# EAGLE design opentx (EAGLE 9.3.2)
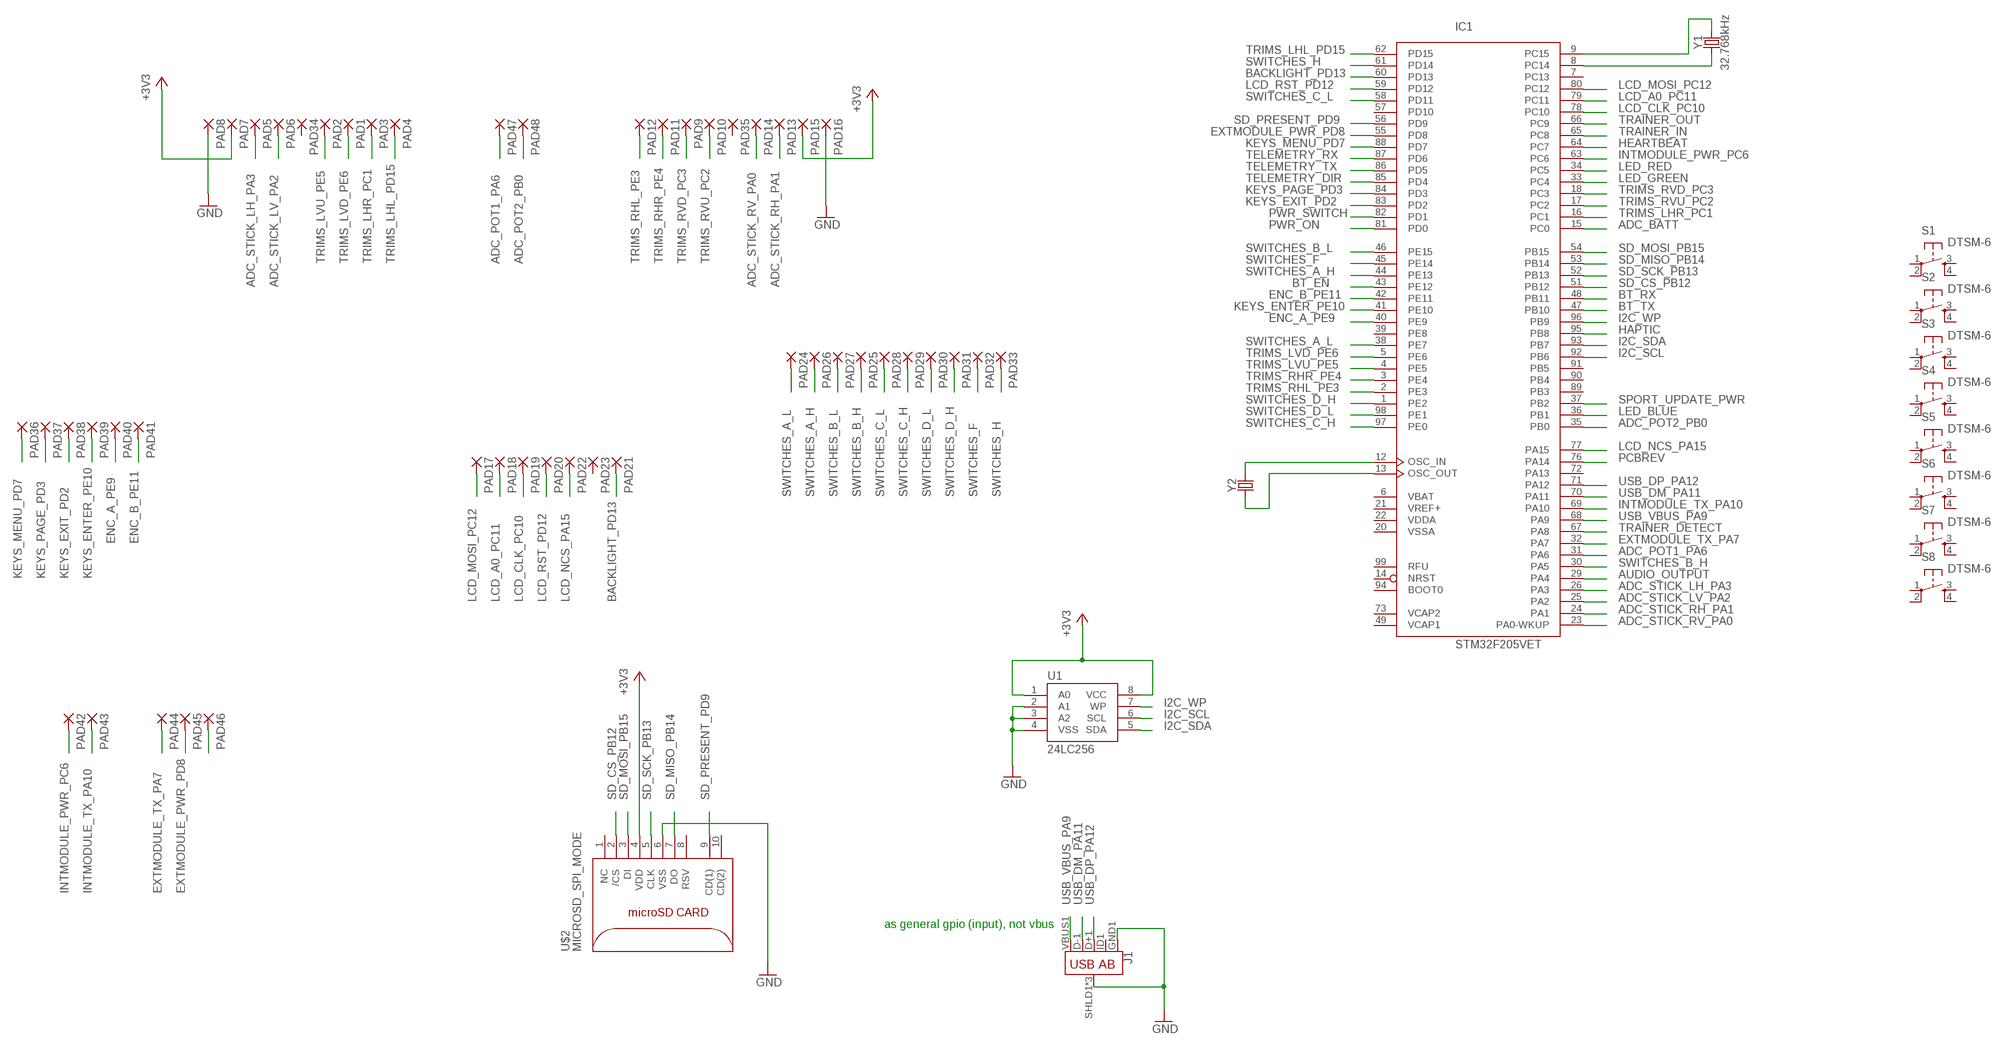
[diagram p0: schematic, sheet 1]

## Parts
IC1  STM32F205VET  [LQFP100]
J1  USB_AB_SMT  [USB-AB-MICRO-SMD]
PAD1  SMD2  [SMD1,27-2,54]
PAD2  SMD2  [SMD1,27-2,54]
PAD3  SMD2  [SMD1,27-2,54]
PAD4  SMD2  [SMD1,27-2,54]
PAD5  SMD2  [SMD1,27-2,54]
PAD6  SMD2  [SMD1,27-2,54]
PAD7  SMD2  [SMD1,27-2,54]
PAD8  SMD2  [SMD1,27-2,54]
PAD9  SMD2  [SMD1,27-2,54]
PAD10  SMD2  [SMD1,27-2,54]
PAD11  SMD2  [SMD1,27-2,54]
PAD12  SMD2  [SMD1,27-2,54]
PAD13  SMD2  [SMD1,27-2,54]
PAD14  SMD2  [SMD1,27-2,54]
PAD15  SMD2  [SMD1,27-2,54]
PAD16  SMD2  [SMD1,27-2,54]
PAD17  SMD2  [SMD1,27-2,54]
PAD18  SMD2  [SMD1,27-2,54]
PAD19  SMD2  [SMD1,27-2,54]
PAD20  SMD2  [SMD1,27-2,54]
PAD21  SMD2  [SMD1,27-2,54]
PAD22  SMD2  [SMD1,27-2,54]
PAD23  SMD2  [SMD1,27-2,54]
PAD24  SMD2  [SMD1,27-2,54]
PAD25  SMD2  [SMD1,27-2,54]
PAD26  SMD2  [SMD1,27-2,54]
PAD27  SMD2  [SMD1,27-2,54]
PAD28  SMD2  [SMD1,27-2,54]
PAD29  SMD2  [SMD1,27-2,54]
PAD30  SMD2  [SMD1,27-2,54]
PAD31  SMD2  [SMD1,27-2,54]
PAD32  SMD2  [SMD1,27-2,54]
PAD33  SMD2  [SMD1,27-2,54]
PAD34  SMD2  [SMD1,27-2,54]
PAD35  SMD2  [SMD1,27-2,54]
PAD36  SMD2  [SMD1,27-2,54]
PAD37  SMD2  [SMD1,27-2,54]
PAD38  SMD2  [SMD1,27-2,54]
PAD39  SMD2  [SMD1,27-2,54]
PAD40  SMD2  [SMD1,27-2,54]
PAD41  SMD2  [SMD1,27-2,54]
PAD42  SMD2  [SMD1,27-2,54]
PAD43  SMD2  [SMD1,27-2,54]
PAD44  SMD2  [SMD1,27-2,54]
PAD45  SMD2  [SMD1,27-2,54]
PAD46  SMD2  [SMD1,27-2,54]
PAD47  SMD2  [SMD1,27-2,54]
PAD48  SMD2  [SMD1,27-2,54]
S1  DTSM-6  [DTSM-6]
S2  DTSM-6  [DTSM-6]
S3  DTSM-6  [DTSM-6]
S4  DTSM-6  [DTSM-6]
S5  DTSM-6  [DTSM-6]
S6  DTSM-6  [DTSM-6]
S7  DTSM-6  [DTSM-6]
S8  DTSM-6  [DTSM-6]
U1  24LC256  EEPROM-I2CSMD  [SO08]
U$2  MICROSD_SPI_MODE  [MICRO_SD_CONNECTOR]
Y1  32.768kHz  CRYSTAL-32.768KHZSMD-2X6  [CRYSTAL-SMD-2X6-CYL]
Y2  CRYSTALSMD-HC49UP  [HC49UP]

## Nets
+3V3: PAD7.1(P) PAD15.1(P) U1.1(A0) U1.8(VCC) U$2.4(VDD)
ADC_BATT: IC1.15(PC0)
ADC_POT1_PA6: IC1.31(PA6) PAD47.1(P)
ADC_POT2_PB0: IC1.35(PB0) PAD48.1(P)
ADC_STICK_LH_PA3: IC1.26(PA3) PAD5.1(P)
ADC_STICK_LV_PA2: IC1.25(PA2) PAD6.1(P)
ADC_STICK_RH_PA1: IC1.24(PA1) PAD13.1(P)
ADC_STICK_RV_PA0: IC1.23(PA0-WKUP) PAD14.1(P)
AUDIO_OUTPUT: IC1.29(PA4)
BACKLIGHT_PD13: IC1.60(PD13) PAD21.1(P)
BT_EN: IC1.43(PE12)
BT_RX: IC1.48(PB11)
BT_TX: IC1.47(PB10)
ENC_A_PE9: IC1.40(PE9) PAD40.1(P)
ENC_B_PE11: IC1.42(PE11) PAD41.1(P)
EXTMODULE_PWR_PD8: IC1.55(PD8) PAD45.1(P)
EXTMODULE_TX_PA7: IC1.32(PA7) PAD44.1(P)
GND: J1.GND1(GND) J1.SHLD1(SHIELD) J1.SHLD2(SHIELD) J1.SHLD3(SHIELD) PAD8.1(P) PAD16.1(P) U1.2(A1) U1.3(A2) U1.4(VSS) U$2.6(VSS)
HAPTIC: IC1.95(PB8)
HEARTBEAT: IC1.64(PC7)
I2C_SCL: IC1.92(PB6) U1.6(SCL)
I2C_SDA: IC1.93(PB7) U1.5(SDA)
I2C_WP: IC1.96(PB9) U1.7(WP)
INTMODULE_PWR_PC6: IC1.63(PC6) PAD42.1(P)
INTMODULE_TX_PA10: IC1.69(PA10) PAD43.1(P)
KEYS_ENTER_PE10: IC1.41(PE10) PAD39.1(P)
KEYS_EXIT_PD2: IC1.83(PD2) PAD38.1(P)
KEYS_MENU_PD7: IC1.88(PD7) PAD36.1(P)
KEYS_PAGE_PD3: IC1.84(PD3) PAD37.1(P)
LCD_A0_PC11: IC1.79(PC11) PAD18.1(P)
LCD_CLK_PC10: IC1.78(PC10) PAD19.1(P)
LCD_MOSI_PC12: IC1.80(PC12) PAD17.1(P)
LCD_NCS_PA15: IC1.77(PA15) PAD22.1(P)
LCD_RST_PD12: IC1.59(PD12) PAD20.1(P)
LED_BLUE: IC1.36(PB1)
LED_GREEN: IC1.33(PC4)
LED_RED: IC1.34(PC5)
N$1: IC1.8(PC14) Y1.X1
N$2: IC1.9(PC15) Y1.X2
N$3: IC1.12(OSC_IN) Y2.2
N$4: IC1.13(OSC_OUT) Y2.1
N$7: PAD46.1(P)
PCBREV: IC1.76(PA14)
PWR_ON: IC1.81(PD0)
PWR_SWITCH: IC1.82(PD1)
SD_CS_PB12: IC1.51(PB12) U$2.2(/CS)
SD_MISO_PB14: IC1.53(PB14) U$2.7(DO)
SD_MOSI_PB15: IC1.54(PB15) U$2.3(DI)
SD_PRESENT_PD9: IC1.56(PD9) U$2.9(CD(1))
SD_SCK_PB13: IC1.52(PB13) U$2.5(CLK)
SPORT_UPDATE_PWR: IC1.37(PB2)
SWITCHES_A_H: IC1.44(PE13) PAD26.1(P)
SWITCHES_A_L: IC1.38(PE7) PAD24.1(P)
SWITCHES_B_H: IC1.30(PA5) PAD25.1(P)
SWITCHES_B_L: IC1.46(PE15) PAD27.1(P)
SWITCHES_C_H: IC1.97(PE0) PAD29.1(P)
SWITCHES_C_L: IC1.58(PD11) PAD28.1(P)
SWITCHES_D_H: IC1.1(PE2) PAD31.1(P)
SWITCHES_D_L: IC1.98(PE1) PAD30.1(P)
SWITCHES_F: IC1.45(PE14) PAD32.1(P)
SWITCHES_H: IC1.61(PD14) PAD33.1(P)
TELEMETRY_DIR: IC1.85(PD4)
TELEMETRY_RX: IC1.87(PD6)
TELEMETRY_TX: IC1.86(PD5)
TRAINER_DETECT: IC1.67(PA8)
TRAINER_IN: IC1.65(PC8)
TRAINER_OUT: IC1.66(PC9)
TRIMS_LHL_PD15: IC1.62(PD15) PAD4.1(P)
TRIMS_LHR_PC1: IC1.16(PC1) PAD3.1(P)
TRIMS_LVD_PE6: IC1.5(PE6) PAD1.1(P)
TRIMS_LVU_PE5: IC1.4(PE5) PAD2.1(P)
TRIMS_RHL_PE3: IC1.2(PE3) PAD12.1(P)
TRIMS_RHR_PE4: IC1.3(PE4) PAD11.1(P)
TRIMS_RVD_PC3: IC1.18(PC3) PAD9.1(P)
TRIMS_RVU_PC2: IC1.17(PC2) PAD10.1(P)
USB_DM_PA11: IC1.70(PA11) J1.D-1(D-)
USB_DP_PA12: IC1.71(PA12) J1.D+1(D+)
USB_VBUS_PA9: IC1.68(PA9) J1.VBUS1(VBUS)
Unconnected: IC1.7(PC13) IC1.14(NRST) IC1.39(PE8) IC1.57(PD10) IC1.72(PA13) IC1.89(PB3) IC1.90(PB4) IC1.91(PB5) IC1.94(BOOT0) IC1.99(RFU) J1.ID1(USBID) PAD23.1(P) PAD34.1(P) PAD35.1(P) S1.1 S1.2 S1.3 S1.4 S2.1 S2.2 S2.3 S2.4 S3.1 S3.2 S3.3 S3.4 S4.1 S4.2 S4.3 S4.4 S5.1 S5.2 S5.3 S5.4 S6.1 S6.2 S6.3 S6.4 S7.1 S7.2 S7.3 S7.4 S8.1 S8.2 S8.3 S8.4 U$2.1(NC) U$2.8(RSV) U$2.10(CD(2))

## Notes on the sheet
- as general gpio (input), not vbus

## Power pins joined to a net without a drawn wire
VBAT: IC1.6(VBAT)
VCAP1: IC1.49(VCAP1)
VCAP2: IC1.73(VCAP2)
VDD: IC1.11(VDD) IC1.19(VDD) IC1.28(VDD) IC1.50(VDD) IC1.75(VDD) IC1.100(VDD)
VDDA: IC1.22(VDDA)
VREF+: IC1.21(VREF+)
VSS: IC1.10(VSS) IC1.27(VSS) IC1.74(VSS)
VSSA: IC1.20(VSSA)

## Library data of the parts
IC1 = micro-stm:STM32F205V*T: ARM 32-bit Cortex™-M3 CPU 120 MHz maximum frequency 128 to 1024 Kbytes of Flash memory 64 to 128 kbytes of SRAM 82 GPIOs 1.8 to 3.6 V application supply
J1 = SparkFun-Connectors:USB_AB: USB Type AB Micro Connector OTG-compatible. 5 pins, 3 shield pins SparkFun Products: IOIO-OTG <https://www.sparkfun.com/products/13613> SparkFun SAMD21 Mini Breakout <https://www.sparkfun.com/products/13664>; PROD_ID: CONN-11794
PAD1-PAD12 PAD14-PAD48 = wirepad:SMD2: SMD PAD
PAD13 = wirepad:SMD2: SMD PAD; SPICEPREFIX: X
S1-S8 = switch-tact:DTSM-6
U1 = SparkFun-IC-Memory:EEPROM-I2C: I2C EEPROMs, 24LC256 and others 24LC256 Series 256 kb I2C 2 Wire (32 k x 8 Bit) 2.5 V Serial EEPROM SMD - SOIC-8 Datasheet SparkFun Products SparkFun UDB5 - PIC UAV Development Board <https://www.sparkfun.com/products/11703> (GPS-11703); PROD_ID: IC-09714
U$2 = con-molex-microsd:MICROSD_SPI_MODE: MOLEX - 49225-0821 - CONNECTEUR MICRO SD PUSH/PUSH REV Fabricant: MOLEX Code commande Farnell: 1366700 <http://fr.farnell.com/molex/49225-0821/connecteur-micro-sd-push-push-rev/dp/1366700?Ntt=1366700> Référence fabricant: 49225-0821
Y1 = SparkFun-Clocks:CRYSTAL-32.768KHZ: 32.768kHz Crystal Frequency: 32.768kHz Frequency Stability: ±20ppm Load Capacitance: 12.5pF (PTH-2X6 & SMD-3.2X1.5), 6pF (SMD-2X6) SparkFun Products: SparkFun BigTime Watch Kit <https://www.sparkfun.com/products/11734> SparkFun nRF52832 Breakout <https://www.sparkfun.com/products/13990> SparkFun Real Time Clock Module <https://www.sparkfun.com/products/12708>; PROD_ID: XTAL-07894
Y2 = SparkFun-Clocks:CRYSTAL: Crystals (Generic) These are passive quartz crystals, which can be used as a clock source for a microcontroller. Crystal's are two-terminal devices. They require external "load" capacitors to generate an oscillating signal.

## Board
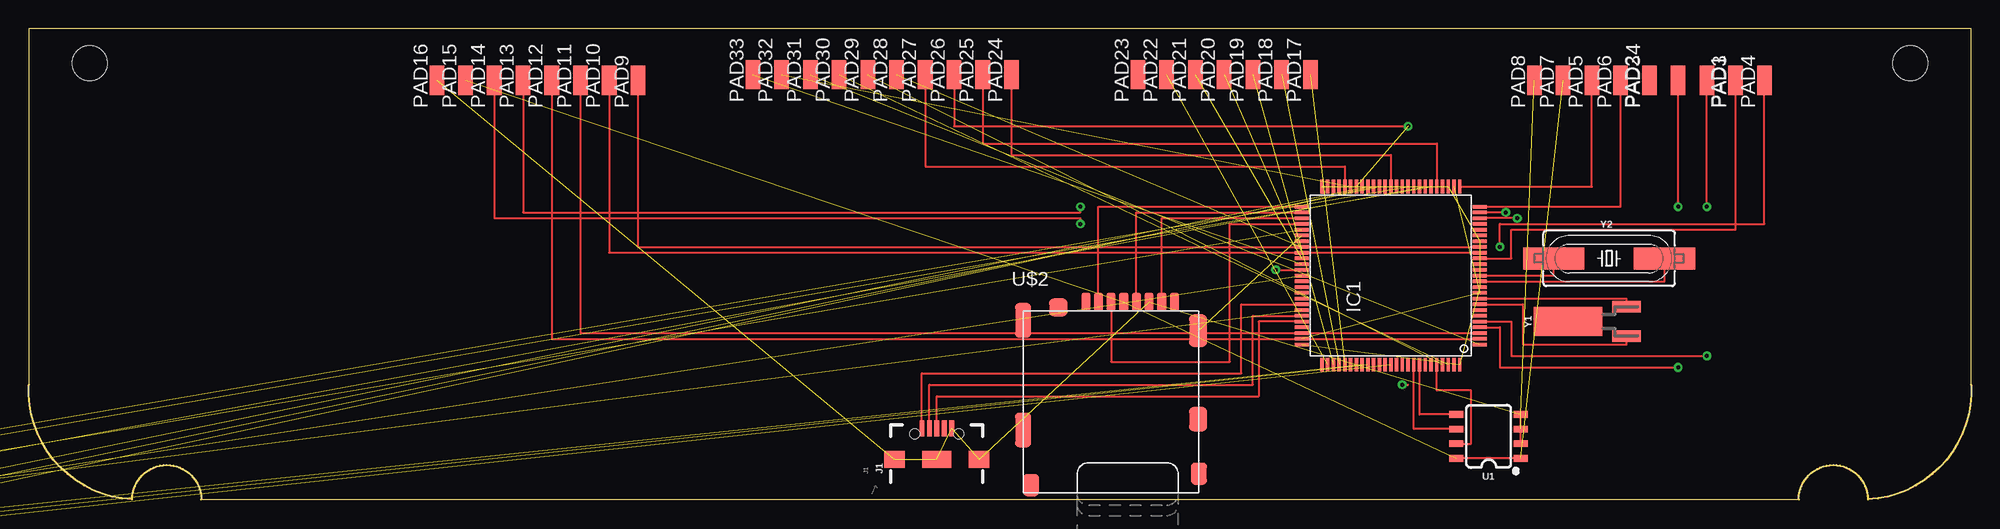
[diagram p1: board, top side]
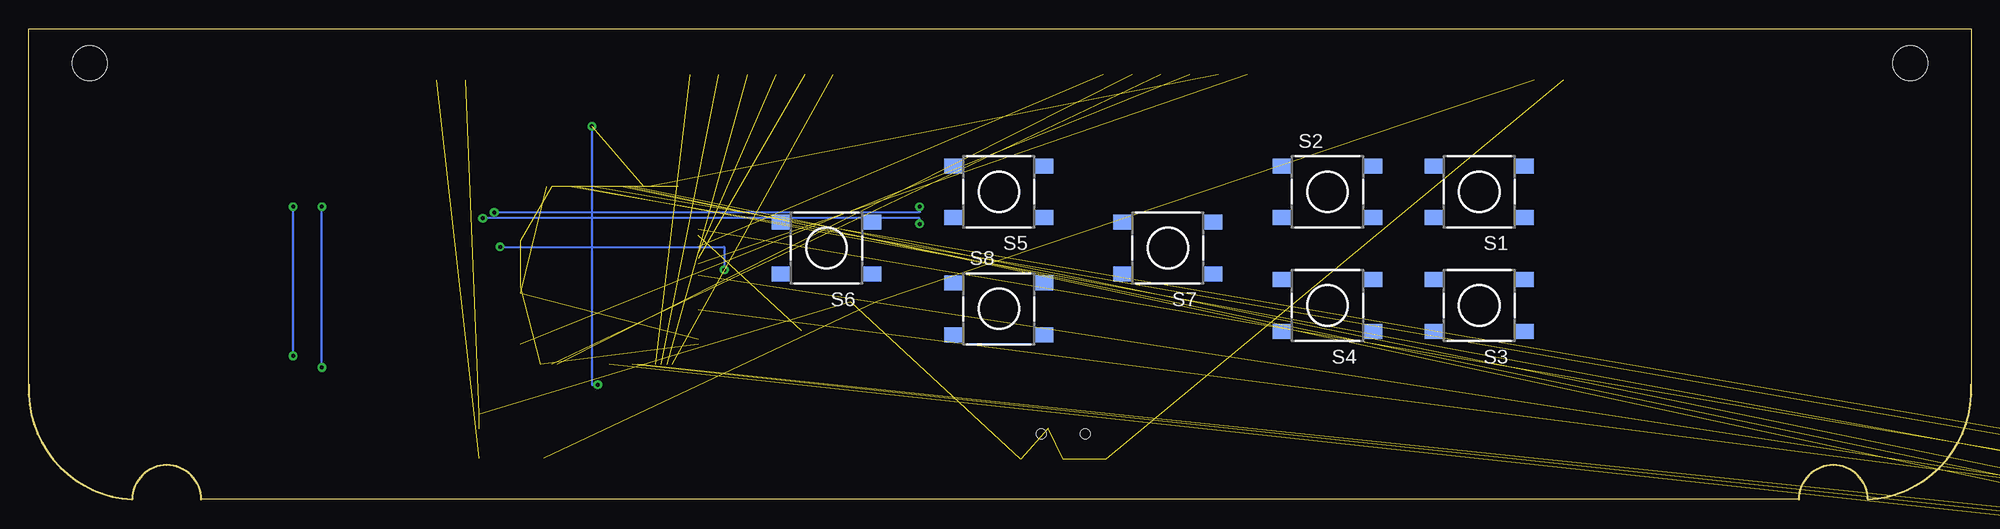
[diagram p2: board, bottom side, seen from below]

Size 169.01 x 41 mm. Coordinates in mm from the lower left corner, seen from the top.
Outline: 15.01,0 40.51,0 53.71,0 101.81,0 154.01,0 arc-180 160.01,0 arc90 169.01,10 169.01,41 101.81,41 53.71,41 40.51,41 0.01,41 0.01,10 arc90 9.01,0 arc-180 15.01,0
Copper layers (1*16): Top 0.035mm / dielectric 1.5mm / Bottom 0.035mm
Design rules "default": minimum track width 6mil, minimum drill 0.35mm, track to track 6mil, track to pad 6mil, pad to pad 6mil, via to via 6mil, smd to smd 6mil, copper to edge 40mil, drill to drill 6mil, minimum pad ring 10mil, minimum via ring 8mil, stop-mask expansion 4mil, vias tented up to drill 0mil, thermal gap 10mil
Holes 3 mm at 5.31,38 163.71,38

### Footprints (pad centres in the part's own frame; a part is rotated, then mirrored left to right if it is on the bottom)
LQFP100 = smd 0.3 x 1.2: 1 -6,-7.75; 2 -5.5,-7.75; 3 -5,-7.75; 4 -4.5,-7.75; 5 -4,-7.75; 6 -3.5,-7.75; 7 -3,-7.75; 8 -2.5,-7.75; 9 -2,-7.75; 10 -1.5,-7.75; 11 -1,-7.75; 12 -0.5,-7.75; 13 0,-7.75; 14 0.5,-7.75; 15 1,-7.75; 16 1.5,-7.75; 17 2,-7.75; 18 2.5,-7.75; 19 3,-7.75; 20 3.5,-7.75; 21 4,-7.75; 22 4.5,-7.75; 23 5,-7.75; 24 5.5,-7.75; 25 6,-7.75; 51 6,7.75; 52 5.5,7.75; 53 5,7.75; 54 4.5,7.75; 55 4,7.75; 56 3.5,7.75; 57 3,7.75; 58 2.5,7.75; 59 2,7.75; 60 1.5,7.75; 61 1,7.75; 62 0.5,7.75; 63 0,7.75; 64 -0.5,7.75; 65 -1,7.75; 66 -1.5,7.75; 67 -2,7.75; 68 -2.5,7.75; 69 -3,7.75; 70 -3.5,7.75; 71 -4,7.75; 72 -4.5,7.75; 73 -5,7.75; 74 -5.5,7.75; 75 -6,7.75 | smd 1.2 x 0.3: 26 7.75,-6; 27 7.75,-5.5; 28 7.75,-5; 29 7.75,-4.5; 30 7.75,-4; 31 7.75,-3.5; 32 7.75,-3; 33 7.75,-2.5; 34 7.75,-2; 35 7.75,-1.5; 36 7.75,-1; 37 7.75,-0.5; 38 7.75,0; 39 7.75,0.5; 40 7.75,1; 41 7.75,1.5; 42 7.75,2; 43 7.75,2.5; 44 7.75,3; 45 7.75,3.5; 46 7.75,4; 47 7.75,4.5; 48 7.75,5; 49 7.75,5.5; 50 7.75,6; 76 -7.75,6; 77 -7.75,5.5; 78 -7.75,5; 79 -7.75,4.5; 80 -7.75,4; 81 -7.75,3.5; 82 -7.75,3; 83 -7.75,2.5; 84 -7.75,2; 85 -7.75,1.5; 86 -7.75,1; 87 -7.75,0.5; 88 -7.75,0; 89 -7.75,-0.5; 90 -7.75,-1; 91 -7.75,-1.5; 92 -7.75,-2; 93 -7.75,-2.5; 94 -7.75,-3; 95 -7.75,-3.5; 96 -7.75,-4; 97 -7.75,-4.5; 98 -7.75,-5; 99 -7.75,-5.5; 100 -7.75,-6
USB-AB-MICRO-SMD = smd 1.4 x 0.4: D+1 2.7,0; D-1 2.7,0.65; GND1 2.7,-1.3; ID1 2.7,-0.65; VBUS1 2.7,1.3 | smd 1.5 x 1.8: SHLD1 0,-3.68; SHLD2 0,3.68 | smd 1.5 x 2.5: SHLD3 0,0 | hole 0.85: 2.2,1.9; 2.2,-1.9
SMD1,27-2,54 = smd 1.27 x 2.54: 1 0,0
DTSM-6 = smd 1.55 x 1.3: 1 -3.975,2.25; 2 3.975,2.25; 3 -3.975,-2.25; 4 3.975,-2.25
SO08 = smd 0.6 x 1.2: 1 -1.905,-2.8; 2 -0.635,-2.8; 3 0.635,-2.8; 4 1.905,-2.8; 5 1.905,2.8; 6 0.635,2.8; 7 -0.635,2.8; 8 -1.905,2.8
MICRO_SD_CONNECTOR = smd 0.8 x 1.6: 1 -2.03,8.2; 2 -0.93,8.2; 3 0.17,8.2; 4 1.27,8.2; 5 2.37,8.2; 6 3.47,8.2; 7 4.57,8.2; 8 5.67,8.2 | smd 1.55 x 2.8: 9 7.735,5.7 | smd 1.55 x 2.1: 10 7.735,-2 | smd 1.4 x 1.9: 11 7.81,-6.75; 12 -6.79,-7.75 | smd 1.4 x 3: 13 -7.49,-2.95; 14 -7.49,6.6 | smd 1.6 x 1.55: 15 -4.43,7.725
CRYSTAL-SMD-2X6-CYL = smd 2.5 x 6: SHEILD 0,5.08 | smd 1 x 2.5: X1 -1.27,0; X2 1.27,0
HC49UP = smd 5.334 x 1.93: 1 -4.826,0; 2 4.826,0

### Placement (x,y rotation side)
IC1  118.51,19.5 90 top
J1  79.01,3.5 90 top
PAD1  146.01,36.5 0 top
PAD2  143.51,36.5 0 top
PAD3  148.51,36.5 0 top
PAD4  151.01,36.5 0 top
PAD5  136.01,36.5 0 top
PAD6  138.51,36.5 0 top
PAD7  133.51,36.5 0 top
PAD8  131.01,36.5 0 top
PAD9  53.01,36.5 0 top
PAD10  50.51,36.5 0 top
PAD11  48.01,36.5 0 top
PAD12  45.51,36.5 0 top
PAD13  43.01,36.5 0 top
PAD14  40.51,36.5 0 top
PAD15  38.01,36.5 0 top
PAD16  35.51,36.5 0 top
PAD17  111.51,37 0 top
PAD18  109.01,37 0 top
PAD19  106.51,37 0 top
PAD20  104.01,37 0 top
PAD21  101.51,37 0 top
PAD22  99.01,37 0 top
PAD23  96.51,37 0 top
PAD24  85.51,37 0 top
PAD25  83.01,37 0 top
PAD26  80.51,37 0 top
PAD27  78.01,37 0 top
PAD28  75.51,37 0 top
PAD29  73.01,37 0 top
PAD30  70.51,37 0 top
PAD31  68.01,37 0 top
PAD32  65.51,37 0 top
PAD33  63.01,37 0 top
PAD34  141.01,36.5 0 top
PAD35  -4.49,-2 0 top  (outside the outline)
PAD36  -7.99,-2 0 top  (outside the outline)
PAD37  -11.49,-2 0 top  (outside the outline)
PAD38  -14.99,-2 0 top  (outside the outline)
PAD39  -18.49,-2 0 top  (outside the outline)
PAD40  -21.99,-2 0 top  (outside the outline)
PAD41  -25.49,-2 0 top  (outside the outline)
PAD42  -28.99,-2 0 top  (outside the outline)
PAD43  -32.49,-2 0 top  (outside the outline)
PAD44  -35.99,-2 0 top  (outside the outline)
PAD45  -39.49,-2 0 top  (outside the outline)
PAD46  -42.99,-2 0 top  (outside the outline)
PAD47  -46.49,-2 0 top  (outside the outline)
PAD48  -49.99,-2 0 top  (outside the outline)
S1  42.81,26.8 180 bottom
S2  56.01,26.8 0 bottom
S3  42.81,16.9 180 bottom
S4  56.01,16.9 180 bottom
S5  84.61,26.8 180 bottom
S6  99.61,21.9 180 bottom
S7  69.91,21.9 180 bottom
S8  84.61,16.6 0 bottom
U1  127.01,5.5 90 top
U$2  94.01,9 0 top
Y1  139.01,15.5 90 top
Y2  137.51,21 0 top

### Tracks (layer width: path | path; a pad name or v marks a point on that pad's centre or on a via)
+3V3  (3 unrouted)
  Top 0.152: U1.1 U1.8
ADC_POT1_PA6  (1 unrouted)
ADC_POT2_PB0  (1 unrouted)
ADC_STICK_LH_PA3
  Top 0.152: IC1.26 136.01,27.25 PAD5.1
ADC_STICK_LV_PA2
  Top 0.152: IC1.25 138.51,25.5 PAD6.1
ADC_STICK_RH_PA1  (via drill 0.35)
  Top 0.152: PAD13.1 43.01,25 91.51,25 v91.51,25.5 | v128.51,25 IC1.24
  Bottom 0.152: v91.51,25.5 91.51,25 v128.51,25
ADC_STICK_RV_PA0  (via drill 0.35)
  Top 0.152: PAD14.1 40.51,24.5 91.51,24.5 v91.51,24 | v129.51,24.5 IC1.23
  Bottom 0.152: v91.51,24 91.51,24.5 v129.51,24.5
BACKLIGHT_PD13  (1 unrouted)
ENC_A_PE9  (1 unrouted)
ENC_B_PE11  (1 unrouted)
EXTMODULE_PWR_PD8  (1 unrouted)
EXTMODULE_TX_PA7  (1 unrouted)
GND  (8 unrouted)
  Top 0.152: U1.2 U1.4
I2C_SCL
  Top 0.152: U1.6 120.51,6.13 IC1.92
I2C_SDA
  Top 0.152: U1.5 121.01,7.41 IC1.93
I2C_WP
  Top 0.152: IC1.96 122.51,9.5 125.51,9.5 125.51,4.87 U1.7
INTMODULE_PWR_PC6  (1 unrouted)
INTMODULE_TX_PA10  (1 unrouted)
KEYS_ENTER_PE10  (1 unrouted)
KEYS_EXIT_PD2  (1 unrouted)
KEYS_MENU_PD7  (1 unrouted)
KEYS_PAGE_PD3  (1 unrouted)
LCD_A0_PC11  (1 unrouted)
LCD_CLK_PC10  (1 unrouted)
LCD_MOSI_PC12  (1 unrouted)
LCD_NCS_PA15  (1 unrouted)
LCD_RST_PD12  (1 unrouted)
N$1
  Top 0.152: Y1.X1 139.01,13.5 130.01,13.5 130.01,17 IC1.8
N$2
  Top 0.152: Y1.X2 139.01,17.5 IC1.9
N$3
  Top 0.152: IC1.12 142.33,19 Y2.2
N$4
  Top 0.152: IC1.13 132.68,19.5 Y2.1
SD_CS_PB12
  Top 0.152: U$2.2 93.08,25.5 IC1.51
SD_MISO_PB14
  Top 0.152: U$2.7 98.58,24.5 IC1.53
SD_MOSI_PB15
  Top 0.152: IC1.54 104.51,24 104.51,12 94.18,12 U$2.3
SD_PRESENT_PD9  (1 unrouted)
SD_SCK_PB13
  Top 0.152: U$2.5 96.38,25 IC1.52
SWITCHES_A_H  (via drill 0.35)  (1 unrouted)
  Top 0.152: PAD26.1 80.51,32.5 v120.01,32.5 | v119.51,10 120.01,10
  Bottom 0.152: v120.01,32.5 120.01,10 v119.51,10
SWITCHES_A_L
  Top 0.152: PAD24.1 85.51,30 118.51,30 IC1.38
SWITCHES_B_H
  Top 0.152: PAD25.1 83.01,31 122.51,31 IC1.30
SWITCHES_B_L
  Top 0.152: PAD27.1 78.01,29 114.51,29 IC1.46
SWITCHES_C_H  (1 unrouted)
SWITCHES_C_L  (1 unrouted)
SWITCHES_D_H  (1 unrouted)
SWITCHES_D_L  (1 unrouted)
SWITCHES_F  (1 unrouted)
SWITCHES_H  (1 unrouted)
TRIMS_LHL_PD15  (via drill 0.35)
  Top 0.152: PAD4.1 151.01,24 128.01,24 v128.01,22 | v108.51,20 IC1.62
  Bottom 0.152: v128.01,22 108.51,22 v108.51,20
TRIMS_LHR_PC1
  Top 0.152: IC1.16 129.01,21 129.01,23.5 148.51,23.5 PAD3.1
TRIMS_LVD_PE6  (via drill 0.35)
  Top 0.152: IC1.5 129.01,15.5 129.01,12.5 v146.01,12.5 | v146.01,25.5 PAD1.1
  Bottom 0.152: v146.01,12.5 v146.01,25.5
TRIMS_LVU_PE5  (via drill 0.35)
  Top 0.152: IC1.4 128.01,15 128.01,11.5 v143.51,11.5 | v143.51,25.5 PAD2.1
  Bottom 0.152: v143.51,11.5 v143.51,25.5
TRIMS_RHL_PE3
  Top 0.152: PAD12.1 45.51,14 IC1.2
TRIMS_RHR_PE4
  Top 0.152: PAD11.1 48.01,14.5 IC1.3
TRIMS_RVD_PC3
  Top 0.152: PAD9.1 53.01,22 IC1.18
TRIMS_RVU_PC2
  Top 0.152: PAD10.1 50.51,21.5 IC1.17
USB_DM_PA11
  Top 0.152: J1.D-1 78.36,10 106.51,10 106.51,16 IC1.70
USB_DP_PA12
  Top 0.152: J1.D+1 79.01,9 107.01,9 107.01,15.5 IC1.71
USB_VBUS_PA9
  Top 0.152: J1.VBUS1 77.71,11 105.51,11 105.51,17 IC1.68
VDD  (5 unrouted)
VSS  (2 unrouted)